# EAGLE schematic arduino1 (EAGLE 9.6.2)
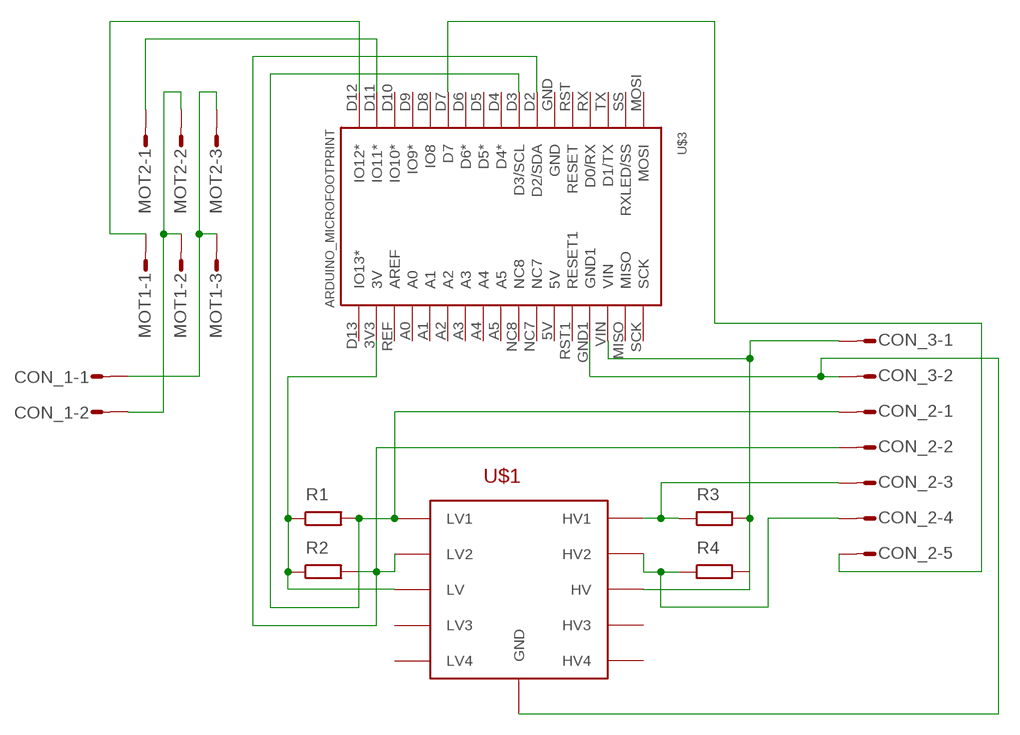
[diagram p0: schematic, sheet 1]

## Parts
CON_1  S02P  [S02P]
CON_2  S05P  [S05P]
CON_3  S02P  [S02P]
MOT1  S03P  [S03P]
MOT2  S03P  [S03P]
R1  R  (no package)
R2  R  (no package)
R3  R  (no package)
R4  R  (no package)
U$3  ARDUINO_MICROFOOTPRINT  [ARDUINO-MICRO]

## Nets
GND: CON_3.2 U$3.GND1 ; supply symbol labelled SHIFTER
HV: CON_3.1 R3.2 R4.2 U$3.VIN ; supply symbol labelled SHIFTER
LV: R1.1 R2.1 U$3.3V3(3V) ; supply symbol labelled SHIFTER
N$3: CON_2.1 R1.2 U$3.D3(D3/SCL) ; supply symbol labelled SHIFTER
N$4: CON_2.2 R2.2 U$3.D2(D2/SDA) ; supply symbol labelled SHIFTER
N$5: CON_1.1 MOT1.3 MOT2.3
N$6: CON_1.2 MOT1.2 MOT2.2
N$10: MOT2.1 U$3.D11(IO11*)
N$12: MOT1.1 U$3.D12(IO12*)
N$13: CON_2.5 U$3.D7
N$14: CON_2.4 R4.1 ; supply symbol labelled SHIFTER
N$16: CON_2.3 R3.1 ; supply symbol labelled SHIFTER
Unconnected: U$3.5V U$3.A0 U$3.A1 U$3.A2 U$3.A3 U$3.A4 U$3.A5 U$3.D4(D4*) U$3.D5(D5*) U$3.D6(D6*) U$3.D8(IO8) U$3.D9(IO9*) U$3.D10(IO10*) U$3.D13(IO13*) U$3.GND U$3.MISO U$3.MOSI U$3.NC7 U$3.NC8 U$3.REF(AREF) U$3.RST1(RESET1) U$3.RST(RESET) U$3.RX(D0/RX) U$3.SCK U$3.SS(RXLED/SS) U$3.TX(D1/TX)

## Library data of the parts
CON_1 CON_3 = con-amp-mt:S02P: AMP MT CONNECTOR; OC_FARNELL: unknown; OC_NEWARK: unknown
CON_2 = con-amp-mt:S05P: AMP MT CONNECTOR; OC_FARNELL: unknown; OC_NEWARK: unknown
MOT1 MOT2 = con-amp-mt:S03P: AMP MT CONNECTOR; OC_FARNELL: unknown; OC_NEWARK: unknown
R1-R4 = ngspice-simulation:R: RESISTOR
U$3 = arduino-micro:ARDUINO_MICRO